# Altium schematic sheet ADJ_LDO.SchDoc
size A4
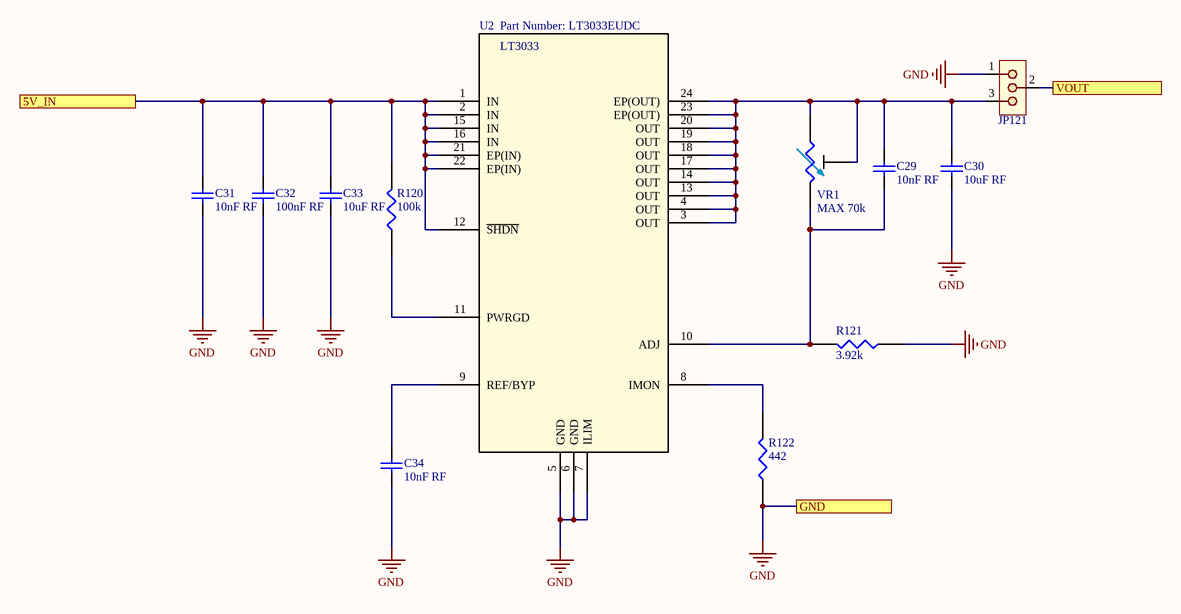
[diagram p0: ADJ_LDO.SchDoc]

## Parts
C29  10nF RF  [C0805]
C30  10uF RF  [C0805]
C31  10nF RF  [C0805]
C32  100nF RF  [C0805]
C33  10uF RF  [C0805]
C34  10nF RF  [C0805]
JP121  Jumper  [01x03_0.1in_th_straight_b_nom]  (value not drawn)
R120  100k  [R0805]
R121  3.92k  [R0805]
R122  442  [R0805]
U2  Part Number: LT3033EUDC  [LT3033]
VR1  MAX 70k  [res_var_5turn]

## Ports
5V_IN, GND, VOUT

## Nets
GND: C30.1 C31.1 C32.1 C33.1 C34.1 JP121.1 R121.1 R122.1 U2.5(GND) U2.6(GND) U2.7(ILIM) ; port GND
5V_IN: C31.2 C32.2 C33.2 R120.2 U2.1(IN) U2.2(IN) U2.12(~{SHDN}) U2.15(IN) U2.16(IN) U2.21(EP(IN)) U2.22(EP(IN)) ; port 5V_IN
VOUT: JP121.2 ; port VOUT
NetC29_1: C29.1 R121.2 U2.10(ADJ) VR1.3
NetC29_2: C29.2 C30.2 JP121.3 U2.3(OUT) U2.4(OUT) U2.13(OUT) U2.14(OUT) U2.17(OUT) U2.18(OUT) U2.19(OUT) U2.20(OUT) U2.23(EP(OUT)) U2.24(EP(OUT)) VR1.1 VR1.2
NetC34_2: C34.2 U2.9(REF/BYP)
NetR120_1: R120.1 U2.11(PWRGD)
NetR122_2: R122.2 U2.8(IMON)

## Notes on the sheet
- (in symbol LT3033EUDC) LT3033

## Library data of the parts
C29-C34 = UMK212SD103KD-T: CAP 10nF 50V RF; Manufacturer: Taiyo Yuden; Dielectric Material: Ceramic; Tolerance: 10%; Supplier 1: Digi-Key; Manufacturer Part Number: UMK212SD103KD-T; Stock 1: 14125; Pricing 1: 1=0.47, 10=0.323, 100=0.1941, 500=0.1455, 1000=0.1229 (USD); Mount: Surface Mount; Case/Package: 0805; Number of Pins: 2; Case Code (Metric): 2012; Case Code (Imperial): 0805; Min Operating Temperature: -55°C; Max Operating Temperature: 125°C; Capacitance: 10nF; Packaging: Tape and Reel; Package Quantity: 1; Voltage Rating: 50V; Voltage Rating (DC): 50V; Termination: SMD/SMT; Length: 2mm; Height: 0.85mm; Width: 0.049inch; Thickness: 0.037inch; Depth: 1.25mm; Radiation Hardening: No; Lead Free: Lead Free; Halogen Free: Halogen Free; ComponentLink1URL: https://datasheet.ciiva.com/138/umk212sd103kd-t-ss-138661.pdf; ComponentLink1Description: https://datasheet.ciiva.com/138/umk212sd103kd-t-ss-138661.pdf; ComponentLink2URL: https://datasheet.ciiva.com/138/mlcc07-e-138662.pdf; ComponentLink2Description: https://datasheet.ciiva.com/138/mlcc07-e-138662.pdf; ComponentLink3URL: https://datasheet.ciiva.com/138/mlcc07-e-138663.pdf; ComponentLink3Description: https://datasheet.ciiva.com/138/mlcc07-e-138663.pdf; ComponentLink4URL: https://datasheet.ciiva.com/30140/303umk212sd103kd-t-30140925.pdf; ComponentLink4Description: https://datasheet.ciiva.com/30140/303umk212sd103kd-t-30140925.pdf; Supplier Part Number 1: 587-1114-1-ND
JP121 = Jumper-01x03: 01X03 generic terminal connector
R120-R122 = RES
U2 = LT3033EUDC: No Description Available; Vendor: Analog Devices Inc; Built_By: Analog_Devices_Team; Manufacturer_Part_Number: LT3033EUDC; Copyright: Copyright (C) 2018 Accelerated Designs. All rights reserved; RefDes: RefDes; Type: DEV; Value: Value
VR1 = Var_RES